# Altium schematic sheet Gate_Driver_Connectors.SchDoc
size A4; SheetNumber: 1; SheetTotal: 5
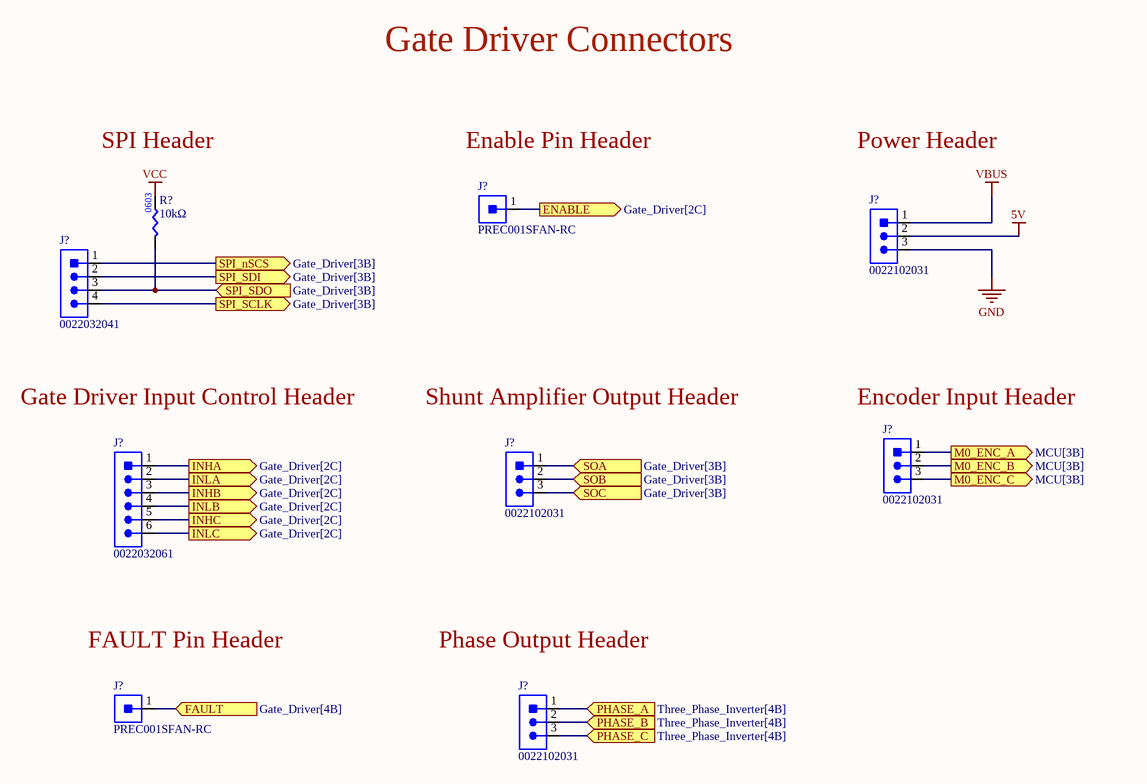
[diagram p0: Gate_Driver_Connectors.SchDoc]

## Parts
(Parts that share a designator on the sheet are numbered #1, #2 ... from top to bottom, then left to right.)
J?#1  Manufacturer Part Number: PREC001SFAN-RC  [HDR_MALE_1X1]  (hidden comment: CON_1X1_2.54MM_MALE_TH_HDR)
J?#2  CON_3X1_2.54MM_MALE_TH_HDR  [0022102031]  (value not drawn)
J?#3  CON_4X1_2.54MM_MALE_TH_HDR  [0022032041]  (value not drawn)
J?#4  CON_3X1_2.54MM_MALE_TH_HDR  [0022102031]  (value not drawn)
J?#5  Manufacturer Part Number 1: 0022032061  [0022284060]  (hidden comment: CON_6X1_2.54MM_MALE_TH_HDR)
J?#6  CON_3X1_2.54MM_MALE_TH_HDR  [0022102031]  (value not drawn)
J?#7  Manufacturer Part Number: PREC001SFAN-RC  [HDR_MALE_1X1]  (hidden comment: CON_1X1_2.54MM_MALE_TH_HDR)
J?#8  CON_3X1_2.54MM_MALE_TH_HDR  [0022102031]  (value not drawn)
R?  value 10kΩ  [RES0603]  (hidden comment: RES_10kΩ_0603_1%)

## Ports
ENABLE (out, see Gate_Driver[2C]), FAULT (in, see Gate_Driver[4B]), INHA (out, see Gate_Driver[2C]), INHB (out, see Gate_Driver[2C]), INHC (out, see Gate_Driver[2C]), INLA (out, see Gate_Driver[2C]), INLB (out, see Gate_Driver[2C]), INLC (out, see Gate_Driver[2C]), M0_ENC_A (out, see MCU[3B]), M0_ENC_B (out, see MCU[3B]), M0_ENC_C (out, see MCU[3B]), PHASE_A (in, see Three_Phase_Inverter[4B]), PHASE_B (in, see Three_Phase_Inverter[4B]), PHASE_C (in, see Three_Phase_Inverter[4B]), SOA (in, see Gate_Driver[3B]), SOB (in, see Gate_Driver[3B]), SOC (in, see Gate_Driver[3B]), SPI_nSCS (out, see Gate_Driver[3B]), SPI_SCLK (out, see Gate_Driver[3B]), SPI_SDI (out, see Gate_Driver[3B]), SPI_SDO (in, see Gate_Driver[3B])

## Nets
5V: J?#2.2
GND: J?#2.3
VBUS: J?#2.1
VCC: R?.2
ENABLE: J?#1.1 ; port ENABLE
FAULT: J?#7.1 ; port FAULT
INHA: J?#5.1 ; port INHA
INHB: J?#5.3 ; port INHB
INHC: J?#5.5 ; port INHC
INLA: J?#5.2 ; port INLA
INLB: J?#5.4 ; port INLB
INLC: J?#5.6 ; port INLC
M0_ENC_A: J?#4.1 ; port M0_ENC_A
M0_ENC_B: J?#4.2 ; port M0_ENC_B
M0_ENC_C: J?#4.3 ; port M0_ENC_C
PHASE_A: J?#8.1 ; port PHASE_A
PHASE_B: J?#8.2 ; port PHASE_B
PHASE_C: J?#8.3 ; port PHASE_C
SOA: J?#6.1 ; port SOA
SOB: J?#6.2 ; port SOB
SOC: J?#6.3 ; port SOC
SPI_nSCS: J?#3.1 ; port SPI_nSCS
SPI_SCLK: J?#3.4 ; port SPI_SCLK
SPI_SDI: J?#3.2 ; port SPI_SDI
SPI_SDO: J?#3.3 R?.1 ; port SPI_SDO

## Notes on the sheet
- Gate Driver Connectors
- SPI Header
- Enable Pin Header
- Power Header
- Gate Driver Input Control Header
- Shunt Amplifier Output Header
- (near J?#4) Encoder Input Header
- FAULT Pin Header
- Phase Output Header

## Library data of the parts
J?#1 J?#7 = CON_1X1_2.54MM_MALE_TH_HDR: Male Conn Header Vert 1POS Through Hole; Manufacturer: Sullins; Number of Positions: 1; Connector Type: Male Pin; Supplier 1: Digi-Key; RoHS: Yes; Category: Connectors; Stock 1: 29218; Pricing 1: 1=0.05000, 10=0.03400, 25=0.03160, 50=0.02360, 100=0.02020, 250=0.01948, 500=0.01680 (USD); Mount: Through Hole; Color: Black; Contact Plating: Tin; Package Quantity: 1; Number of Rows: 1; Packaging: Bulk; Termination: Solder; Series: -; Contact Type: Male Pin; Contact Mating Length: 0.318inch; ComponentLink1URL: https://datasheet.ciiva.com/740/xrxczzzsxxn-rc-st-11635-b-740964.pdf?src-supplier=Digi-Key; ComponentLink1Description: https://datasheet.ciiva.com/740/xrxczzzsxxn-rc-st-11635-b-740964.pdf?src-supplier=Digi-Key; Supplier Part Number 1: S1212EC-01-ND
J?#2 J?#4 J?#6 J?#8 = CON_3X1_2.54MM_MALE_VERT_TH_HDR: CONN HEADER 3X1 2.54MM MALE VERT TH; Manufacturer 1: Molex; Number of Positions: 3; Supplier 1: Digi-Key; Mounting Type: Through Hole; Connector Type: Header; Contact Type: Male Pin; Pitch: 2.54mm; Number of Rows: 1; Supplier Part Number 1: WM2723-ND; Manufacturer Part Number 1: 0022102031
J?#3 = CON_4X1_2.54MM_MALE_TH_HDR: CONN HEADER 4X1 2.54MM MALE VERT TH; Manufacturer 1: Molex; Number of Positions: 4; Supplier 1: Digi-Key; Supplier Part Number 1: WM4002-ND; Mounting Type: Through Hole; Connector Type: Header; Contact Type: Male Pin; Pitch: 2.54mm; Number of Rows: 1; Manufacturer Part Number 1: 0022032041
J?#5 = CON_6X1_2.54MM_MALE_TH_HDR: CONN HEADER 6X1 2.54MM MALE VERT TH; Manufacturer 1: Molex; Number of Positions: 6; Mounting Type: Through Hole; Pitch: 2.54mm; Number of Rows: 1; Connector Type: Header; Contact Type: Male Pin; Supplier 1: Digi-Key; Supplier Part Number 1: WM4004-ND
R? = RES_10kΩ_0603_1%: RES 10K OHM ±1% 1/10W 0603; Manufacturer 1: Yageo; Manufacturer Part Number 1: RC0603FR-0710KL; Supplier 1: Digi-Key; Supplier Part Number 1: 311-10.0KHRCT-ND; Tolerance: ±1%; Package: 0603; Mounting Type: Surface Mount; Power Rating: 1/10W